# EAGLE design uson_wson_breakout (EAGLE 8.4.0)
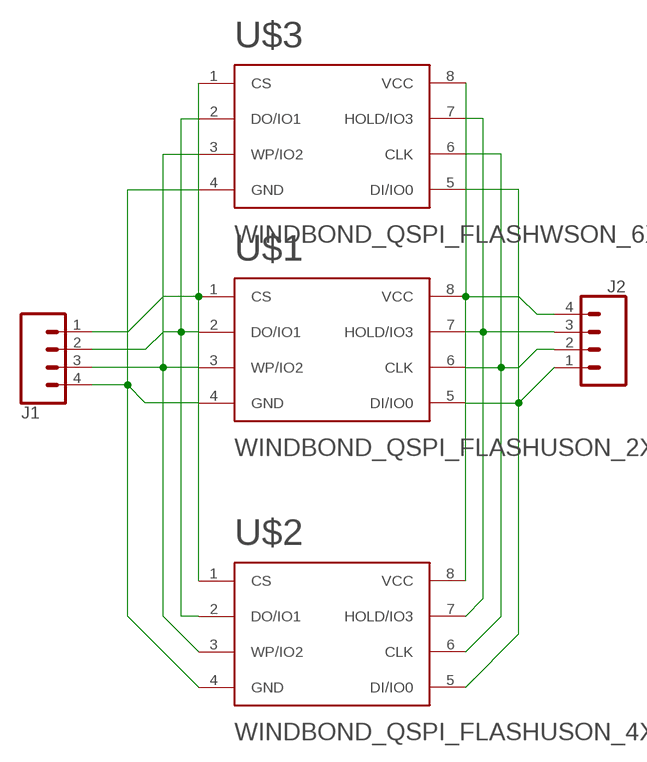
[diagram p0: schematic, sheet 1]

## Parts
J1  CONN_041X04_NO_SILK  [1X04_NO_SILK]
J2  CONN_041X04_NO_SILK  [1X04_NO_SILK]
U$1  WINDBOND_QSPI_FLASHUSON_2X3  [USON_2X3MM]
U$2  WINDBOND_QSPI_FLASHUSON_4X3  [USON_4X3MM]
U$3  WINDBOND_QSPI_FLASHWSON_6X5  [WSON_6X5MM]

## Nets
3V3: J2.4 U$1.8(VCC) U$2.8(VCC) U$3.8(VCC)
CLK: J2.2 U$1.6(CLK) U$2.6(CLK) U$3.6(CLK)
CS: J1.1 U$1.1(CS) U$2.1(CS) U$3.1(CS)
DI/IO0: J2.1 U$1.5(DI/IO0) U$2.5(DI/IO0) U$3.5(DI/IO0)
DO/IO1: J1.2 U$1.2(DO/IO1) U$2.2(DO/IO1) U$3.2(DO/IO1)
GND: J1.4 U$1.4(GND) U$2.4(GND) U$3.4(GND)
HOLD/IO3: J2.3 U$1.7(HOLD/IO3) U$2.7(HOLD/IO3) U$3.7(HOLD/IO3)
WP/IO2: J1.3 U$1.3(WP/IO2) U$2.3(WP/IO2) U$3.3(WP/IO2)

## Library data of the parts
J1 J2 = SparkFun-Connectors:CONN_04: Multi connection point. Often used as Generic Header-pin footprint for 0.1 inch spaced/style header connections On any of the 0.1 inch spaced packages, you can populate with these: Break Away Headers - Straight <https://www.sparkfun.com/products/116> (PRT-00116) Break Away Male Headers - Right Angle <https://www.sparkfun.com/products/553> (PRT-00553) Female Headers <https://www.sparkfun.com/products/115> (PRT-00115) Break Away Headers - Machine Pin <https://www.sparkfun.com/products/117> (PRT-00117) Break Away Female Headers - Swiss Machine Pin <https://www.sparkfun.com/products/743> (PRT-00743) For SCREWTERMINALS and SPRING TERMINALS visit here: Screw Terimnals on SparkFun.com <https://www.sparkfun.com/search/results?term=Screw+Terminals> (5mm/3.5mm/2.54mm spacing) This device is also useful as a general connection point to wire up your design to another part of your project. Our various solder wires solder well into these plated through hole pads. Hook-Up Wire - Assortment (Stranded, 22 AWG) <https://www.sparkfun.com/products/11375> (PRT-11375) Hook-Up Wire - Assortment (Solid Core, 22 AWG) <https://www.sparkfun.com/products/11367> (PRT-11367) View the entire wire category on our website here <https://www.sparkfun.com/categories/141> Special notes: Molex polarized connector foot print use with SKU : PRT-08231 with associated crimp pins and housings. 1MM SMD Version SKU: PRT-10208; PROD_ID: CONN-09696
U$1-U$3 = 00_bsiepert:WINDBOND_QSPI_FLASH

## Board
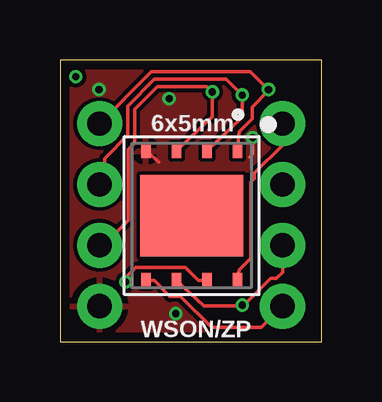
[diagram p1: board, top side]
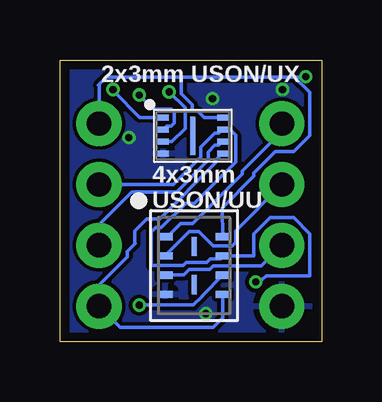
[diagram p2: board, bottom side, seen from below]

Size 10.9 x 11.75 mm. Coordinates in mm from the lower left corner, seen from the top.
Outline: 0,0 10.9,0 10.9,11.75 0,11.75 0,0
Copper layers (1*16): Top 0.035559375mm / dielectric 1.6mm / Bottom 0.035559375mm
Design rules "oshpark-2layer-tented": minimum track width 6mil, minimum drill 10mil, track to track 6mil, track to pad 6mil, pad to pad 6mil, via to via 6mil, smd to smd 6mil, copper to edge 15mil, drill to drill 6mil, minimum pad ring 5mil, minimum via ring 5mil, stop-mask expansion 2.5mil, vias tented up to drill 20mil, thermal gap 10mil

### Footprints (pad centres in the part's own frame; a part is rotated, then mirrored left to right if it is on the bottom)
1X04_NO_SILK = drill 1.016 pad 1.88: 1 0,0; 2 2.54,0; 3 5.08,0; 4 7.62,0
USON_2X3MM = smd 0.45 x 0.25: 1 -1.23,0.75; 2 -1.23,0.25; 3 -1.23,-0.25; 4 -1.23,-0.75; 5 1.23,-0.75; 6 1.23,-0.25; 7 1.23,0.25; 8 1.23,0.75 | smd 0.2 x 1.6: PAD 0,0
USON_4X3MM = smd 0.6 x 0.3: 1 -1.2,1.2; 2 -1.2,0.4; 3 -1.2,-0.4; 4 -1.2,-1.2; 5 1.2,-1.2; 6 1.2,-0.4; 7 1.2,0.4; 8 1.2,1.2 | smd 0.2 x 0.8: P$1 0,0.8; P$2 0,-0.8
WSON_6X5MM = smd 0.6 x 0.4: 1 -2.7,1.905; 2 -2.7,0.635; 3 -2.7,-0.635; 4 -2.7,-1.905; 5 2.7,-1.905; 6 2.7,-0.635; 7 2.7,0.635; 8 2.7,1.905 | smd 3.4 x 4.3: PAD 0,0

### Placement (x,y rotation side)
J1  1.65,9.09 270 top
J2  9.27,1.47 90 top
U$1  5.36,8.59 0 bottom
U$2  5.31,3.17 0 bottom
U$3  5.49,5.26 270 top

### Tracks (layer width: path | path; a pad name or v marks a point on that pad's centre or on a via)
3V3  (via drill 0.3)
  Top 0.152: 9.27,8.61 J2.4 9.27,8.21 8.1,7.04 8.1,6.81 7.94,6.65 7.94,3.64 7.95,3.63 7.94,3.62 7.94,3.46 7.47,2.99 U$3.8
  Bottom 0.152: 5.94,11.04 8.95,11.04 9.3,10.69 9.27,10.67 J2.4 | 5.94,11.04 1.13,11.04 | U$2.8 4.13,5.58 2.82,6.9 2.82,7.04 1.93,7.92 1.17,7.92 0.48,8.58 0.48,10.41 1.13,11.04 | 5.94,11.04 5.84,10.94 5.84,10.34 5.38,9.88 5.38,9.61 5.17,9.61 4.89,9.34 U$1.8 | 1.13,11.04 0.67,11.04 v0.66,11.05
CLK  (via drill 0.3)
  Top 0.152: U$3.6 5.99,1.5 7.57,1.5 v7.59,1.52 7.67,1.52 8.79,2.64 9.02,2.64 9.27,2.9 J2.2
  Bottom 0.152: U$1.6 4.28,8.19 4.45,8.19 4.73,7.91 4.73,7.56 6.04,6.25 7.9,6.25 9.27,4.88 J2.2 | U$2.6 4.98,1.9 4.98,1.88 5.34,1.52 v7.59,1.52
CS  (via drill 0.3)
  Top 0.152: U$3.1 7.47,8.76 8,9.3 8,9.78 8.69,10.46 v8.69,10.52 7.92,11.26 6.52,11.26 5.11,11.25 3.81,11.25 J1.1
  Bottom 0.152: J1.1 1.68,9.09 1.68,8.74 3.3,7.11 3.3,6.99 5.36,4.93 5.87,4.93 6.42,4.38 U$2.1 | U$1.1 7.57,9.35 8.69,10.46 v8.69,10.52
DI/IO0
  Top 0.152: J2.1 8.38,0.58 6.33,0.58 5.01,1.88 4.58,1.88 3.93,2.56 U$3.5
  Bottom 0.152: U$1.5 4.42,7.54 4.42,7.44 6.75,5.11 7.29,5.11 7.77,4.62 7.77,4.1 7.77,4.09 8.1,3.76 8.1,3.53 9.27,2.36 J2.1 8.38,0.58 4.52,0.58 4.11,1 U$2.5
DO/IO1  (via drill 0.3)
  Top 0.152: J1.2 1.85,6.76 1.85,7.64 2.82,8.61 2.82,9.83 3.94,10.95 4.85,10.95 6.93,10.95 v7.59,10.29 7.59,9.36 U$3.2
  Bottom 0.152: J1.2 3.58,4.62 3.58,4.13 3.71,4 4.51,4 5.11,4.6 5.5,4.6 5.76,4.34 | U$1.2 6.44,8.98 6.27,8.98 6.14,9.12 6.14,9.55 6.27,9.69 7,9.69 v7.59,10.29 | 5.77,4.34 5.76,4.34 | 5.76,4.34 6.51,3.6 U$2.2
GND  (via drill 0.3)
  Top 0.152: U$3.4 3.94,7.65 | 4.12,7.49 3.98,7.62 3.97,7.62 3.94,7.65 | v8.03,8.51 8.03,7.82 7.9,7.69 | 4.01,7.59 3.95,7.65 3.94,7.65
  other vias: 4.83,1.17 4.55,10.13 1.63,10.52
  pour Bottom: -0.33,12.09 -0.51,11.91 -0.51,-0.91 -0.48,-0.89 11.79,-0.89 11.73,-0.84 11.73,12.57 0.3,12.57 0.28,12.55 -0.18,12.09
  pour Top: -0.23,12.32 -0.18,12.37 11.51,12.37 11.68,12.19 11.68,-0.99 11.48,-1.19 -0.69,-1.19 -0.53,-1.04 -0.53,12.01 -0.25,12.29
  pour Top: -0.58,4.06 12.52,4.06 12.67,4.22 12.67,-0.28 12.37,-0.58 0.15,-0.58 -0.03,-0.76 -0.03,3.71 -0.33,4.01
HOLD/IO3  (via drill 0.3)
  Top 0.152: U$3.7 5.75,2.56 5.22,3.09 3.16,3.09 2.74,2.67 v2.74,2.49
  Bottom 0.152: J2.3 6.17,6.55 5.03,7.69 5.03,8.11 4.45,8.69 4.28,8.69 U$1.7 3.81,8.84 3.58,8.61 3.58,7.49 5.31,5.77 5.66,5.77 6.67,4.75 6.9,4.75 7.09,4.57 7.09,3.17 5.76,3.17 5.63,3.31 4.78,3.31 4.63,3.46 4.22,3.46 U$2.7 2.82,3.58 2.82,4.5 2.13,5.18 1.17,5.18 0.48,4.5 0.48,2.74 2.31,2.74 2.46,2.59 2.64,2.59 v2.74,2.49
WP/IO2  (via drill 0.3)
  Top 0.152: J1.3 1.8,4.01 2.85,5.05 2.85,8 3.12,8.28 3.12,9.7 4.06,10.64 6.12,10.64 v6.35,10.41 6.35,9.38 U$3.3
  Bottom 0.152: U$2.3 5.73,2.77 5.5,3 4.65,3 4.5,3.15 2.51,3.15 J1.3 | U$1.3 6.24,8.34 5.69,8.89 5.69,9.75 v6.35,10.41

### Text on the board
tPlace: 6x5mm | WSON/ZP
bPlace: 2x3mm USON/UX | 4x3mm / USON/UU